# Altium schematic sheet SD.SchDoc
size A
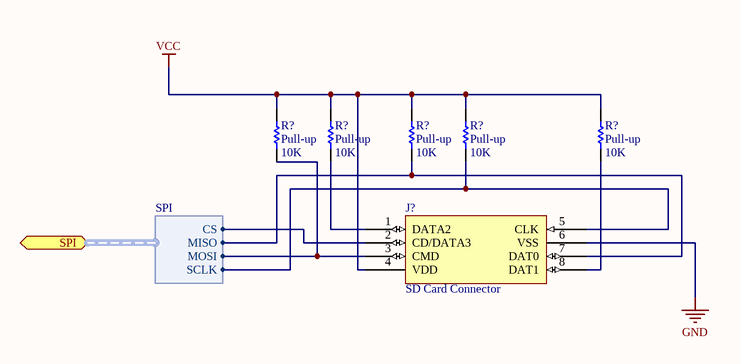
[diagram p0: SD.SchDoc]

## Parts
(Parts that share a designator on the sheet are numbered #1, #2 ... from top to bottom, then left to right.)
J?  SD Card Connector
R?#1  Pull-up  value 10K  [AXIAL-0.3]
R?#2  Pull-up  value 10K  [AXIAL-0.3]
R?#3  Pull-up  value 10K  [AXIAL-0.3]
R?#4  Pull-up  value 10K  [AXIAL-0.3]
R?#5  Pull-up  value 10K  [AXIAL-0.3]

## Ports
SPI (harness SPI)

## Harnesses
SPI: CS, MISO, MOSI, SCLK

## Nets
GND: J?.6(VSS)
VCC: J?.4(VDD) R?#1.2 R?#2.2 R?#3.2 R?#4.2 R?#5.2
NetJ?_1: J?.1(DATA2) R?#2.1
NetJ?_2: J?.2(CD/DATA3) ; port SPI.CS
NetJ?_3: J?.3(CMD) R?#1.1 ; port SPI.MOSI
NetJ?_5: J?.5(CLK) R?#4.1 ; port SPI.SCLK
NetJ?_7: J?.7(DAT0) R?#3.1 ; port SPI.MISO
NetJ?_8: J?.8(DAT1) R?#5.1

## Library data of the parts
J? = 503182-1853: Producer: Molex; CommandePrototype: Yes; ProducerRef: 503182-1853; Supplier: Farnell; SupplierRef: 2334075
R?#1-R?#5 = Res1: Resistor; Published: 8-Jun-2000; LatestRevisionDate: 17-Jul-2002; LatestRevisionNote: Re-released for DXP Platform.; PackageReference: AXIAL-0.3; Publisher: Altium Limited; PackageDescription: Axial Device, Thru-Hole; 2 Leads; 0.3 in Pin Spacing